# Altium schematic sheet Cherry MX.SchDoc
size 297 x 210 mm
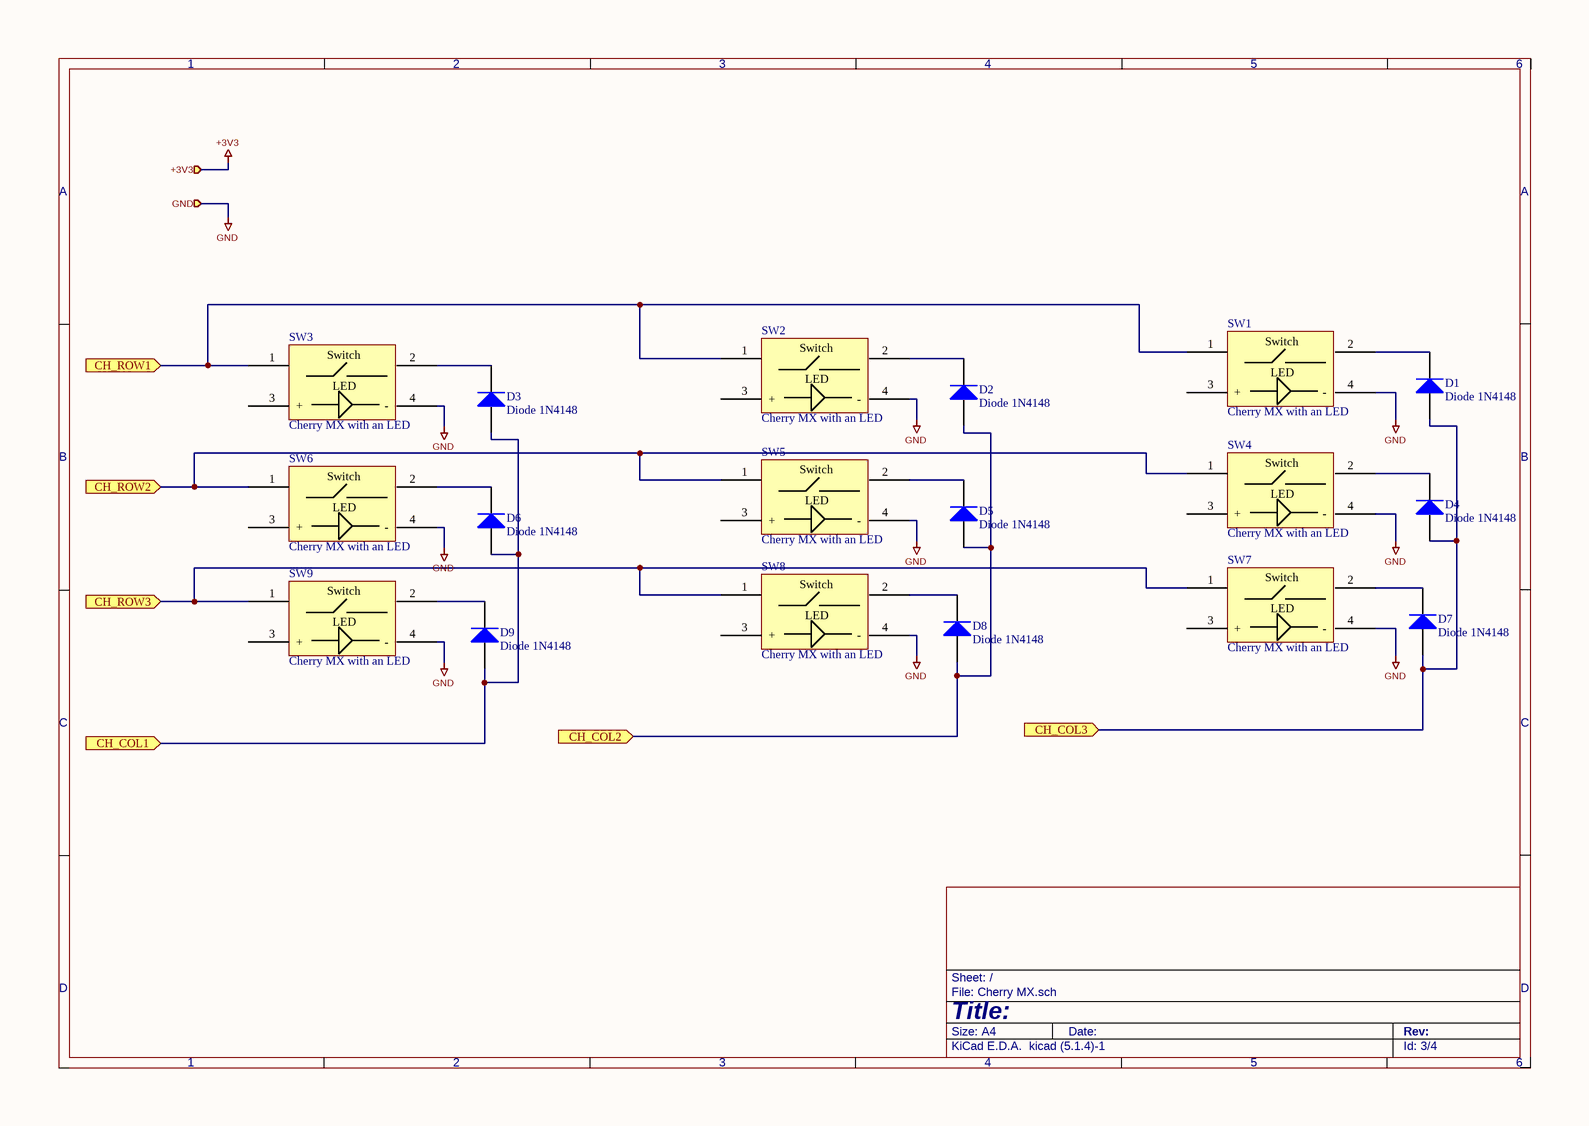
[diagram p0: Cherry MX.SchDoc]

## Parts
D1  Diode 1N4148  [DO-35]
D2  Diode 1N4148  [DO-35]
D3  Diode 1N4148  [DO-35]
D4  Diode 1N4148  [DO-35]
D5  Diode 1N4148  [DO-35]
D6  Diode 1N4148  [DO-35]
D7  Diode 1N4148  [DO-35]
D8  Diode 1N4148  [DO-35]
D9  Diode 1N4148  [DO-35]
SW1  Cherry MX with an LED  [MX_Cherry_LED]
SW2  Cherry MX with an LED  [MX_Cherry_LED]
SW3  Cherry MX with an LED  [MX_Cherry_LED]
SW4  Cherry MX with an LED  [MX_Cherry_LED]
SW5  Cherry MX with an LED  [MX_Cherry_LED]
SW6  Cherry MX with an LED  [MX_Cherry_LED]
SW7  Cherry MX with an LED  [MX_Cherry_LED]
SW8  Cherry MX with an LED  [MX_Cherry_LED]
SW9  Cherry MX with an LED  [MX_Cherry_LED]

## Ports
+3V3 (in), CH_COL1 (in), CH_COL2 (in), CH_COL3 (in), CH_ROW1 (in), CH_ROW2 (in), CH_ROW3 (in), GND (in)

## Nets
+3V3: port +3V3
GND: SW1.4(-) SW2.4(-) SW3.4(-) SW4.4(-) SW5.4(-) SW6.4(-) SW7.4(-) SW8.4(-) SW9.4(-) ; port GND
CH_COL1: D3.1(A) D6.1(A) D9.1(A) ; port CH_COL1
CH_COL2: D2.1(A) D5.1(A) D8.1(A) ; port CH_COL2
CH_COL3: D1.1(A) D4.1(A) D7.1(A) ; port CH_COL3
CH_ROW1: SW1.1 SW2.1 SW3.1 ; port CH_ROW1
CH_ROW2: SW4.1 SW5.1 SW6.1 ; port CH_ROW2
CH_ROW3: SW7.1 SW8.1 SW9.1 ; port CH_ROW3
NetD1_2: D1.2(K) SW1.2
NetD2_2: D2.2(K) SW2.2
NetD3_2: D3.2(K) SW3.2
NetD4_2: D4.2(K) SW4.2
NetD5_2: D5.2(K) SW5.2
NetD6_2: D6.2(K) SW6.2
NetD7_2: D7.2(K) SW7.2
NetD8_2: D8.2(K) SW8.2
NetD9_2: D9.2(K) SW9.2

Not connected (* = marked no-connect by the designer): SW1 3(+); SW2 3(+); SW3 3(+); SW4 3(+); SW5 3(+); SW6 3(+); SW7 3(+); SW8 3(+); SW9 3(+)

## Notes on the sheet
- 1
- 2
- 3
- 4
- 5
- 6
- A
- B
- C
- D
- Title:
- File: Cherry MX.sch
- Sheet: /
- KiCad E.D.A.  kicad (5.1.4)-1
- Size: A4
- Date:
- Rev:
- Id: 3/4
- (in symbol MX_Cherry_LED) Switch; LED

## Library data of the parts
D1-D9 = Diode 1N4148: High Conductance Fast Diode; Published: 8-Jun-2000; LatestRevisionDate: 17-Jul-2002; LatestRevisionNote: Re-released for DXP Platform.; DatasheetVersion: 1997; PackageReference: DO-35; Publisher: Altium Limited; PackageDescription: Diode, Axial; Body 3.8 x 1.9 mm (LxDia. max), Lead Dia. 0.53 mm (max); Code_JEDEC: DO-204-AH; ComponentLink1Description: Manufacturer Link; ComponentLink1URL: http://www.fairchildsemi.com/; ComponentLink2Description: Datasheet; ComponentLink2URL: http://www.fairchildsemi.com/ds/1N%2F1N4148.pdf
SW1-SW9 = MX_Cherry_LED